# EAGLE design chessClock (EAGLE 8.0.1)
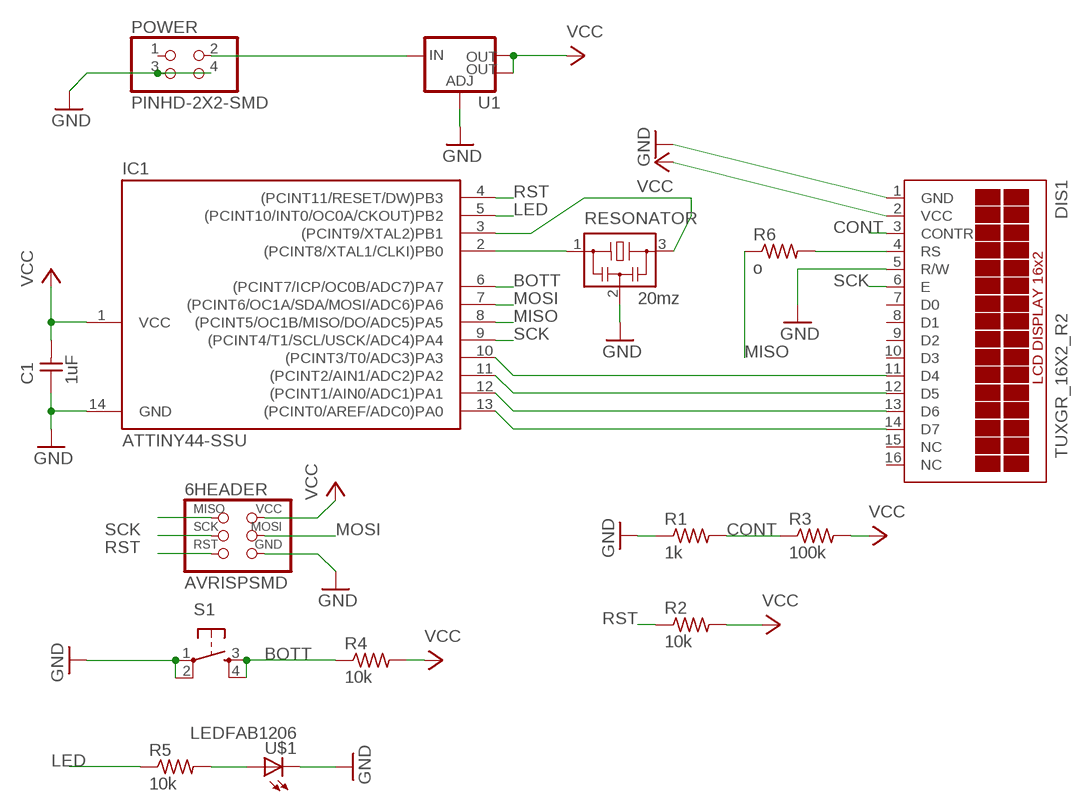
[diagram p0: schematic, sheet 1]

## Parts
6HEADER  AVRISPSMD  [2X03SMD]
C1  1uF  CAP-UNPOLARIZEDFAB  [C1206FAB]
DIS1  TUXGR_16X2_R2  [TUXGR_16X2_R2]
IC1  ATTINY44-SSU  [SOIC14]
POWER  PINHD-2X2-SMD  [2X02SMD]
R1  1k  RES-US1206FAB  [R1206FAB]
R2  10k  RES-US1206FAB  [R1206FAB]
R3  100k  RES-US1206FAB  [R1206FAB]
R4  10k  RES-US1206FAB  [R1206FAB]
R5  10k  RES-US1206FAB  [R1206FAB]
R6  o  RES-US1206FAB  [R1206FAB]
RESONATOR  20mz  RESONATOR  [EFOBM]
S1  6MM_SWITCH6MM_SWITCH  [6MM_SWITCH]
U1  V_REG_LM1117SOT223  [SOT223]
U$1  LEDFAB1206  [LED1206FAB]

## Nets
BOTT: IC1.6((PCINT7/ICP/OC0B/ADC7)PA7) R4.1 S1.3(S) S1.4(S1)
CONT: DIS1.3(CONTR) R1.2 R3.1
GND: 6HEADER.6(GND) C1.1 DIS1.1(GND) DIS1.5(R/W) IC1.14(GND) POWER.3 POWER.4 R1.1 RESONATOR.2 S1.1(P) S1.2(P1) U1.1(ADJ) U$1.2(C)
LED: IC1.5((PCINT10/INT0/OC0A/CKOUT)PB2) R5.1
MISO: 6HEADER.1(MISO) IC1.8((PCINT5/OC1B/MISO/DO/ADC5)PA5) R6.1
MOSI: 6HEADER.4(MOSI) IC1.7((PCINT6/OC1A/SDA/MOSI/ADC6)PA6)
N$1: IC1.3((PCINT9/XTAL2)PB1) RESONATOR.3
N$2: IC1.2((PCINT8/XTAL1/CLKI)PB0) RESONATOR.1
N$3: DIS1.14(D7) IC1.13((PCINT0/AREF/ADC0)PA0)
N$4: DIS1.13(D6) IC1.12((PCINT1/AIN0/ADC1)PA1)
N$5: DIS1.12(D5) IC1.11((PCINT2/AIN1/ADC2)PA2)
N$6: DIS1.11(D4) IC1.10((PCINT3/T0/ADC3)PA3)
N$7: POWER.2 U1.3(IN)
N$8: DIS1.4(RS) R6.2
N$9: R5.2 U$1.1(A)
RST: 6HEADER.5(RST) IC1.4((PCINT11/RESET/DW)PB3) R2.1
SCK: 6HEADER.3(SCK) DIS1.6(E) IC1.9((PCINT4/T1/SCL/USCK/ADC4)PA4)
VCC: 6HEADER.2(VCC) C1.2 DIS1.2(VCC) IC1.1(VCC) R2.2 R3.2 R4.2 U1.2(OUT) U1.4(OUT)
Unconnected: DIS1.7(D0) DIS1.8(D1) DIS1.9(D2) DIS1.10(D3) DIS1.15(NC) DIS1.16(NC) POWER.1

## Library data of the parts
6HEADER = fab:AVRISP
C1 = fab:CAP-UNPOLARIZED
DIS1 = display-lcd:TUXGR_16X2_R2: Tuxgraphics LCD display 16x2 characters reflective, without background light Source: tuxgr_12x2_r2.pdf; OC_FARNELL: unknown; OC_NEWARK: unknown
IC1 = fab:ATTINY44
POWER = fab:PINHD-2X2-SMD
R1-R6 = fab:RES-US: Resistor (US Symbol) Variants with postfix FAB are widened to allow the routing of internal traces
RESONATOR = fab:RESONATOR
S1 = fab:6MM_SWITCH: OMRON SWITCH
U1 = fab:V_REG_LM1117: Voltage Regulator LM1117 Standard adjustable voltage regulator but in SMD form. Spark Fun Electronics SKU : COM-00595; PROD_ID: VREG-08170
U$1 = fab:LED: LED

## Board
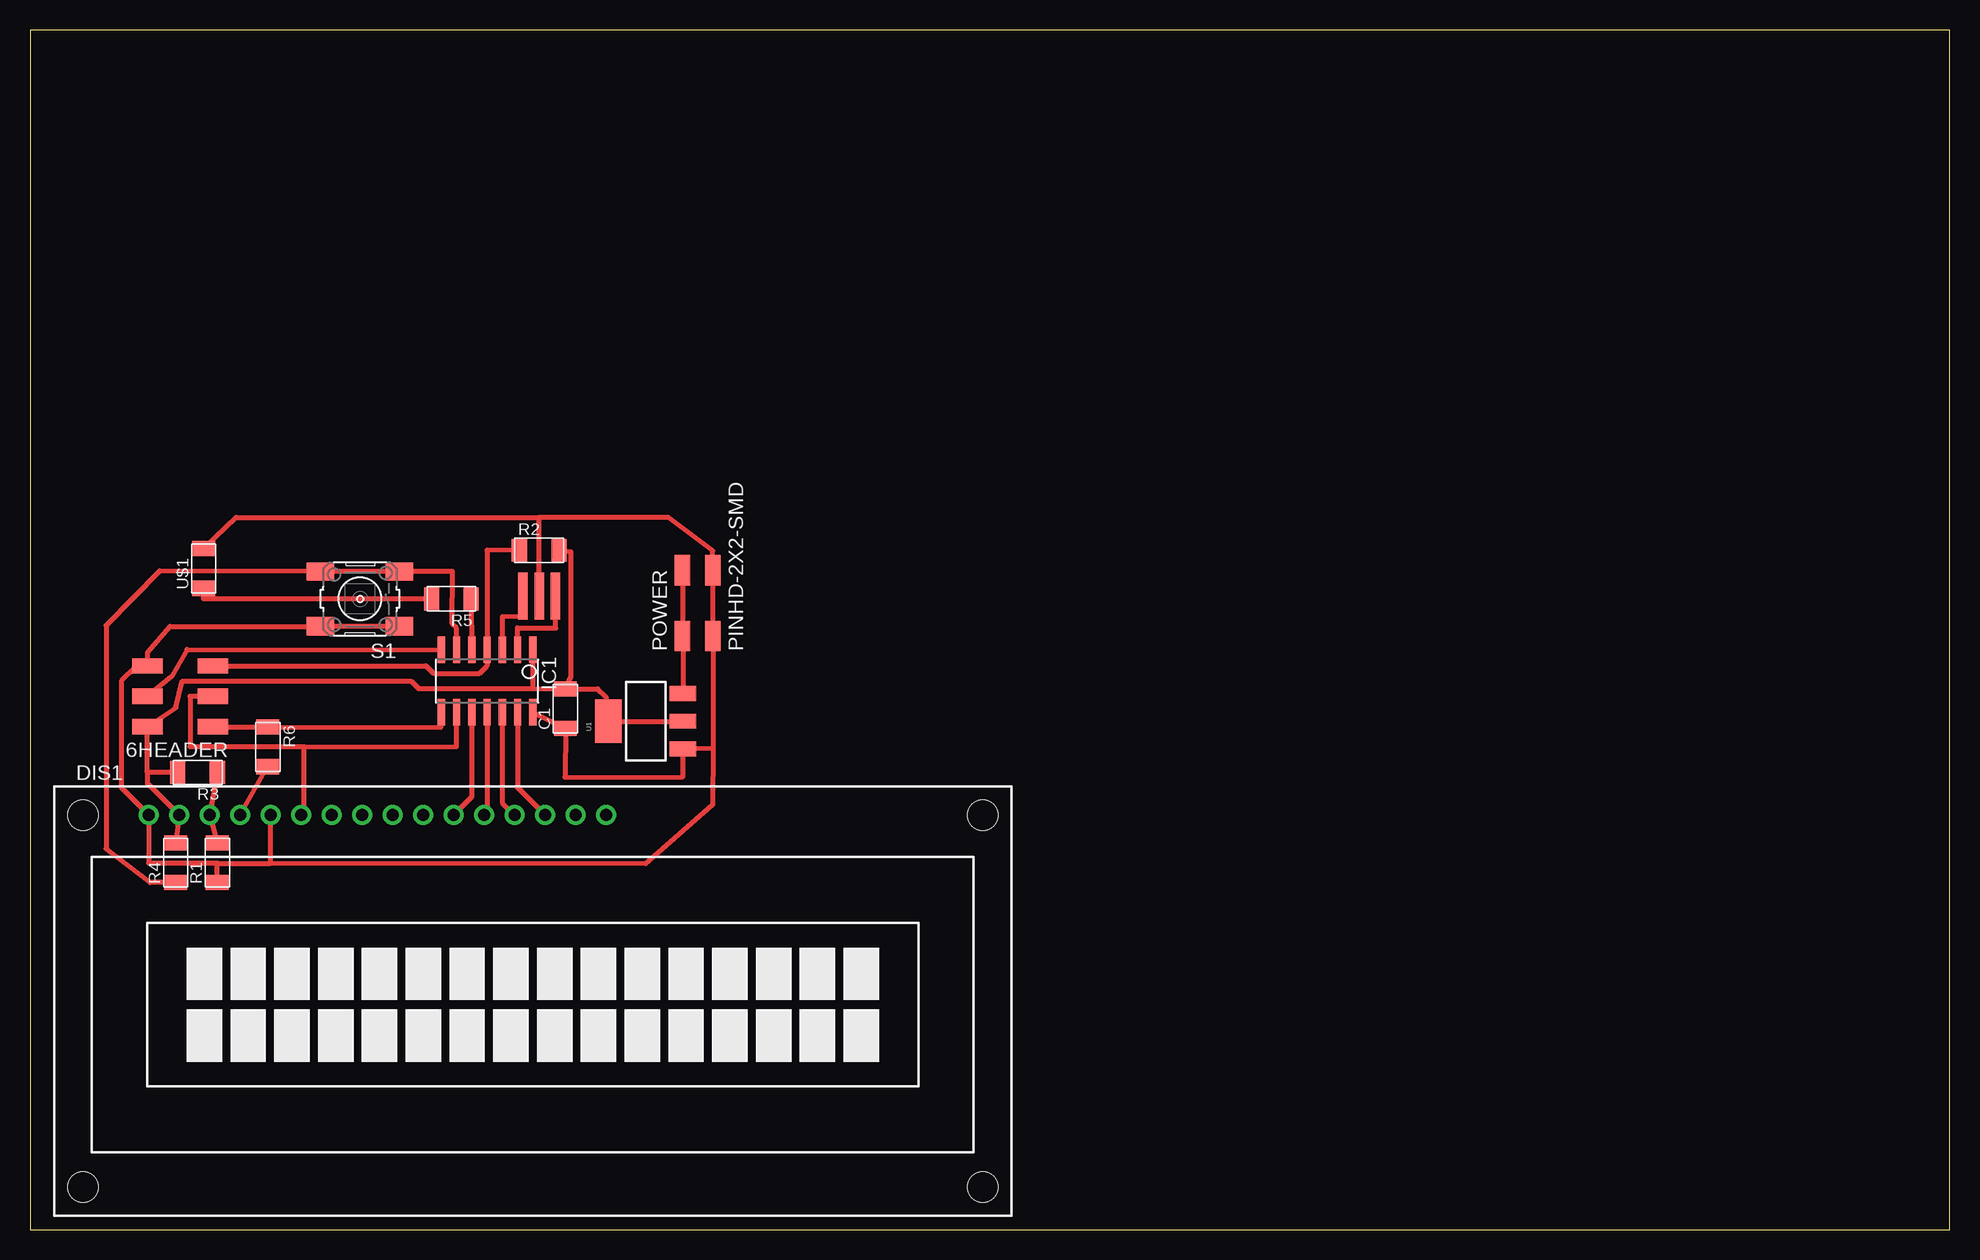
[diagram p1: board, top side]

Size 160 x 100 mm. Coordinates in mm from the lower left corner, seen from the top.
Outline: 0,0 160,0 160,100 0,100 0,0
Copper layers (1*16): Top 0.035mm / dielectric 1.5mm / Bottom 0.035mm
Design rules "default": minimum track width 10mil, minimum drill 24mil, track to track 8mil, track to pad 8mil, pad to pad 8mil, via to via 8mil, smd to smd 8mil, copper to edge 40mil, drill to drill 8mil, minimum pad ring 10mil, minimum via ring 8mil, stop-mask expansion 4mil, vias tented up to drill 0mil, thermal gap 10mil

### Footprints (pad centres in the part's own frame; a part is rotated, then mirrored left to right if it is on the bottom)
2X03SMD = smd 2.54 x 1.27: 1 -2.54,2.54; 2 2.92,2.54; 3 -2.54,0; 4 2.92,0; 5 -2.54,-2.54; 6 2.92,-2.54
C1206FAB = smd 1.27 x 1.905: 1 -1.651,0; 2 1.651,0
TUXGR_16X2_R2 = drill 1 pad 1.676: 1 -32,15.5; 2 -29.46,15.5; 3 -26.92,15.5; 4 -24.38,15.5; 5 -21.84,15.5; 6 -19.3,15.5; 7 -16.76,15.5; 8 -14.22,15.5; 9 -11.68,15.5; 10 -9.14,15.5; 11 -6.6,15.5; 12 -4.06,15.5; 13 -1.52,15.5; 14 1.02,15.5; 15 3.56,15.5; 16 6.1,15.5 | hole 2.5: -37.5,-15.5; 37.5,-15.5; -37.5,15.5; 37.5,15.5
SOIC14 = smd 0.61 x 2.21: 1 -3.81,-2.603; 2 -2.54,-2.603; 3 -1.27,-2.603; 4 0,-2.603; 5 1.27,-2.603; 6 2.54,-2.603; 7 3.81,-2.603; 8 3.81,2.603; 9 2.54,2.603; 10 1.27,2.603; 11 0,2.603; 12 -1.27,2.603; 13 -2.54,2.603; 14 -3.81,2.603
2X02SMD = smd 2.54 x 1.27: 1 -2.54,1.27; 2 2.92,1.27; 3 -2.54,-1.27; 4 2.92,-1.27
R1206FAB = smd 1.27 x 1.905: 1 -1.651,0; 2 1.651,0
EFOBM = smd 0.8 x 3.9: 1 -1.35,0; 2 0,0; 3 1.35,0
6MM_SWITCH = smd 2.286 x 1.524: 1 -3.302,2.286; 2 3.302,2.286; 3 -3.302,-2.286; 4 3.302,-2.286
SOT223 = smd 1.219 x 2.235: 1 -2.311,-3.099; 2 0,-3.099; 3 2.311,-3.099 | smd 3.6 x 2.2: 4 0,3.099
LED1206FAB = smd 1.27 x 1.905: 1 -1.651,0; 2 1.651,0

### Placement (x,y rotation side)
6HEADER  12.7,44.45 180 top
C1  44.63,43.42 90 top
DIS1  41.91,19.05 0 top
IC1  38.1,45.72 180 top
POWER  55.65,52.02 90 top
R1  15.61,30.58 90 top
R2  42.45,56.62 0 top
R3  13.97,38.1 180 top
R4  12.15,30.58 90 top
R5  35.12,52.58 180 top
R6  19.82,40.24 270 top
RESONATOR  42.45,52.81 180 top
S1  27.5,52.58 180 top
U1  51.32,42.38 90 top
U$1  14.48,55.12 90 top

### Tracks (layer width: path | path; a pad name or v marks a point on that pad's centre or on a via)
BOTT
  Top 0.406: R4.1 10,28.93 6.35,31.75 6.35,50.36 10.8,54.9 S1.4 S1.3 35.23,54.86 35.2,50.5 35.56,50.14 IC1.6
CONT
  Top 0.406: R3.1 DIS1.3 R1.2
GND
  Top 0.406: 6HEADER.6 8.89,46.99 7.62,45.72 7.62,36.84 DIS1.1 9.89,30.53 15.61,30.53 | 15.61,30.53 20.05,30.53 | 20.05,30.53 20.07,34.04 DIS1.5 | 20.05,30.53 51.32,30.48 56.9,35.4 56.92,40.1 | R1.1 15.61,30.53 | 6HEADER.6 10.16,46.99 | S1.1 S1.2 11.68,50.29 9.8,48.1 6HEADER.6 | 42.45,59.36 17.2,59.36 U$1.2 | RESONATOR.2 42.45,59.36 | 56.92,40.1 POWER.3 POWER.4 56.9,56.6 53.22,59.36 42.45,59.36 | IC1.14 C1.1 44.6,37.7 54.43,37.75 U1.1 56.92,40.1
LED
  Top 0.406: R5.1 IC1.5
MISO
  Top 0.406: IC1.8 34.25,41.88 R6.1 6HEADER.1
MOSI
  Top 0.406: IC1.7 13.1,48.36 11.83,46.12 6HEADER.4
N$1
  Top 0.406: RESONATOR.3 41.17,51.07 39.37,51.1 IC1.3
N$2
  Top 0.406: IC1.2 40.64,50.16 43.81,50.13 RESONATOR.1
N$3
  Top 0.406: IC1.13 40.64,36.84 DIS1.14
N$4
  Top 0.406: IC1.12 39.37,35.57 DIS1.13
N$5
  Top 0.406: IC1.11 38.1,34.8 DIS1.12
N$6
  Top 0.406: IC1.10 36.83,36.07 DIS1.11
N$7
  Top 0.406: POWER.2 U1.3
N$8
  Top 0.406: DIS1.4 R6.2
N$9
  Top 0.406: R5.2 14.47,52.58 U$1.1
RST
  Top 0.406: 6HEADER.5 33.02,46.99 33.66,46.35 37.47,46.35 38.1,46.99 IC1.4 38.1,56.63 R2.1
SCK
  Top 0.406: 6HEADER.3 13.34,44.45 13.34,40.24 22.86,40.24 | 22.86,40.24 35.56,40.27 IC1.9 | DIS1.6 22.86,34.8 22.86,40.24
VCC
  Top 0.406: 9.78,38.1 9.78,37.22 DIS1.2 R4.2 | 9.78,38.1 6HEADER.2 12.16,43.48 12.7,45.72 31.75,45.72 32.38,45.09 41.91,45.09 | IC1.1 41.91,45.09 | R3.2 9.78,38.1 | 41.91,45.09 C1.2 | C1.2 45.1,46.1 45.1,56.5 R2.2 | U1.2 U1.4 48,44.4 47.33,45.07 C1.2